# Altium schematic sheet BLE.SchDoc
size A4; SheetNumber: 4; SheetTotal: 7
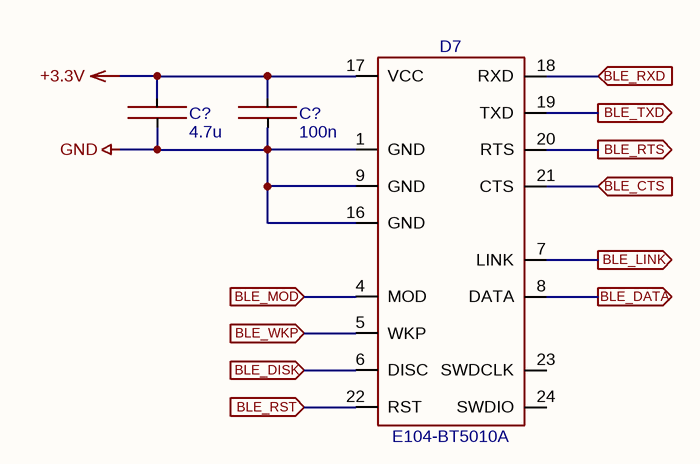
[diagram p0: BLE.SchDoc]

## Parts
(Parts that share a designator on the sheet are numbered #1, #2 ... from top to bottom, then left to right.)
C?#1  4.7u  [CAPC1608X09N]
C?#2  100n  [CAPC1608X09N]
D7  E104-BT5010A  [EBYTE E104]

## Ports
BLE_CTS (in), BLE_DATA (out), BLE_DISK (in), BLE_LINK (out), BLE_MOD (in), BLE_RST (in), BLE_RTS (out), BLE_RXD (in), BLE_TXD (out), BLE_WKP (in)

## Nets
+3.3V: C?#1.2 C?#2.2 D7.17(VCC)
GND: C?#1.1 C?#2.1 D7.1(GND) D7.9(GND) D7.16(GND)
BLE_CTS: D7.21(CTS) ; port BLE_CTS
BLE_DATA: D7.8(DATA) ; port BLE_DATA
BLE_DISK: D7.6(DISC) ; port BLE_DISK
BLE_LINK: D7.7(LINK) ; port BLE_LINK
BLE_MOD: D7.4(MOD) ; port BLE_MOD
BLE_RST: D7.22(RST) ; port BLE_RST
BLE_RTS: D7.20(RTS) ; port BLE_RTS
BLE_RXD: D7.18(RXD) ; port BLE_RXD
BLE_TXD: D7.19(TXD) ; port BLE_TXD
BLE_WKP: D7.5(WKP) ; port BLE_WKP

Not connected (* = marked no-connect by the designer): D7 23(SWDCLK) 24(SWDIO)

## Library data of the parts
C?#1 = C0603-4.7u-10V-X5R-10%: GRM188R61A475K
C?#2 = C0603-100n-25V-X7R-10%: GRM188R71E104KA01D